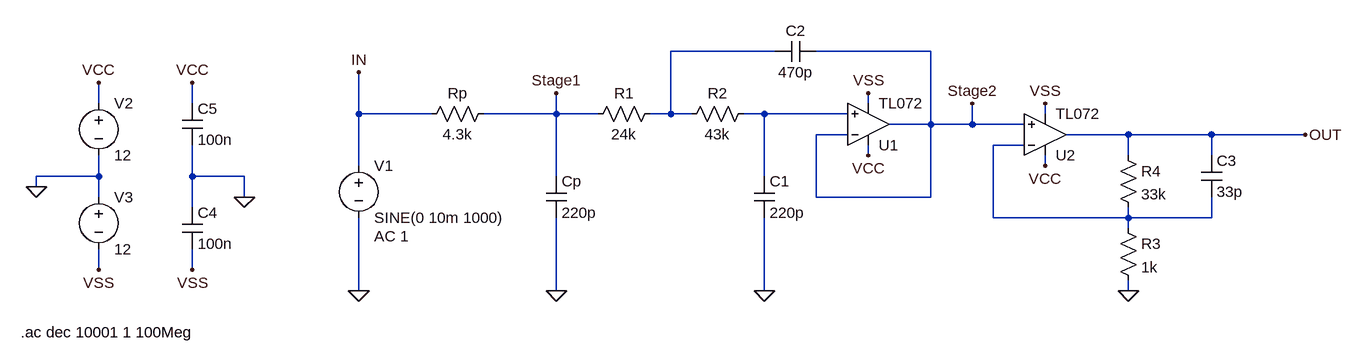
[diagram p0: schematic SK_ordnung4_10kHz_1dB_30dB_butter_2OPV.asc]
SK_ordnung4_10kHz_1dB_30dB_butter_2OPV.asc, the LTspice schematic file:
Version 4
SHEET 1 1316 736
WIRE 432 112 272 112
WIRE 672 112 496 112
WIRE -608 192 -608 160
WIRE -464 192 -464 160
WIRE 576 192 576 176
WIRE -208 208 -208 144
WIRE -96 208 -208 208
WIRE 96 208 96 176
WIRE 96 208 -16 208
WIRE 160 208 96 208
WIRE 272 208 272 112
WIRE 272 208 240 208
WIRE 304 208 272 208
WIRE 416 208 384 208
WIRE 544 208 416 208
WIRE 848 208 848 192
WIRE 672 224 672 112
WIRE 672 224 608 224
WIRE 736 224 736 192
WIRE 736 224 672 224
WIRE 816 224 736 224
WIRE 544 240 496 240
WIRE 976 240 880 240
WIRE 1104 240 976 240
WIRE 1248 240 1104 240
WIRE 816 256 768 256
WIRE 576 272 576 256
WIRE 976 272 976 240
WIRE 1104 272 1104 240
WIRE -208 288 -208 208
WIRE 848 288 848 272
WIRE -608 304 -608 272
WIRE -608 304 -704 304
WIRE -464 304 -464 256
WIRE -384 304 -464 304
WIRE 96 304 96 208
WIRE 416 304 416 208
WIRE -704 320 -704 304
WIRE -608 336 -608 304
WIRE -384 336 -384 304
WIRE 496 336 496 240
WIRE 672 336 672 224
WIRE 672 336 496 336
WIRE -464 352 -464 304
WIRE 768 368 768 256
WIRE 976 368 976 352
WIRE 976 368 768 368
WIRE 1104 368 1104 336
WIRE 1104 368 976 368
WIRE 976 384 976 368
WIRE -608 448 -608 416
WIRE -464 448 -464 416
WIRE -208 480 -208 368
WIRE 96 480 96 368
WIRE 416 480 416 368
WIRE 976 480 976 464
FLAG 976 480 0
FLAG 416 480 0
FLAG -608 160 VCC
FLAG -608 448 VSS
FLAG 576 176 VSS
FLAG 848 192 VSS
FLAG 576 272 VCC
FLAG 848 288 VCC
FLAG -704 320 0
FLAG -464 160 VCC
FLAG -464 448 VSS
FLAG -384 336 0
FLAG -208 480 0
FLAG 1248 240 OUT
FLAG 736 192 Stage2
FLAG -208 144 IN
FLAG 96 480 0
FLAG 96 176 Stage1
SYMBOL res 256 192 R90
WINDOW 0 0 56 VBottom 2
WINDOW 3 32 56 VTop 2
SYMATTR InstName R1
SYMATTR Value 24k
SYMBOL res 400 192 R90
WINDOW 0 0 56 VBottom 2
WINDOW 3 32 56 VTop 2
SYMATTR InstName R2
SYMATTR Value 43k
SYMBOL res 960 368 R0
SYMATTR InstName R3
SYMATTR Value 1k
SYMBOL res 960 256 R0
SYMATTR InstName R4
SYMATTR Value 33k
SYMBOL cap 400 304 R0
SYMATTR InstName C1
SYMATTR Value 220p
SYMBOL cap 496 96 R90
WINDOW 0 0 32 VBottom 2
WINDOW 3 32 32 VTop 2
SYMATTR InstName C2
SYMATTR Value 470p
SYMBOL voltage -208 272 R0
WINDOW 123 24 124 Left 2
WINDOW 39 0 0 Left 0
SYMATTR Value2 AC 1
SYMATTR InstName V1
SYMATTR Value SINE(0 10m 1000)
SYMBOL voltage -608 176 R0
WINDOW 123 0 0 Left 0
WINDOW 39 0 0 Left 0
SYMATTR InstName V2
SYMATTR Value 12
SYMBOL voltage -608 320 R0
WINDOW 123 0 0 Left 0
WINDOW 39 0 0 Left 0
SYMATTR InstName V3
SYMATTR Value 12
SYMBOL cap -480 192 R0
SYMATTR InstName C5
SYMATTR Value 100n
SYMBOL cap -480 352 R0
SYMATTR InstName C4
SYMATTR Value 100n
SYMBOL TL072 576 288 M180
SYMATTR InstName U1
SYMBOL TL072 848 304 M180
SYMATTR InstName U2
SYMBOL cap 80 304 R0
SYMATTR InstName Cp
SYMATTR Value 220p
SYMBOL res 0 192 R90
WINDOW 0 0 56 VBottom 2
WINDOW 3 32 56 VTop 2
SYMATTR InstName Rp
SYMATTR Value 4.3k
SYMBOL cap 1088 272 R0
SYMATTR InstName C3
SYMATTR Value 33p
TEXT -728 544 Left 2 !.ac dec 10001 1 100Meg

The netlist it stands for:
* SK_ordnung4_10kHz_1dB_30dB_butter_2OPV.asc
R1 N001 Stage1 24k
R2 N002 N001 43k
R3 N003 0 1k
R4 OUT N003 33k
C1 N002 0 220p
C2 Stage2 N001 470p
V1 IN 0 SINE(0 10m 1000) AC 1
V2 VCC 0 12
V3 0 VSS 12
C5 VCC 0 100n
C4 0 VSS 100n
* U1: TL072 (symbol TL072 not available, pins judged from their places): In+=N002 In-=Stage2 V+=VCC V-=VSS OUT=Stage2
* U2: TL072 (symbol TL072 not available, pins judged from their places): In+=Stage2 In-=N003 V+=VCC V-=VSS OUT=OUT
Cp Stage1 0 220p
Rp Stage1 IN 4.3k
C3 OUT N003 33p
.ac dec 10001 1 100Meg
.backanno
.end